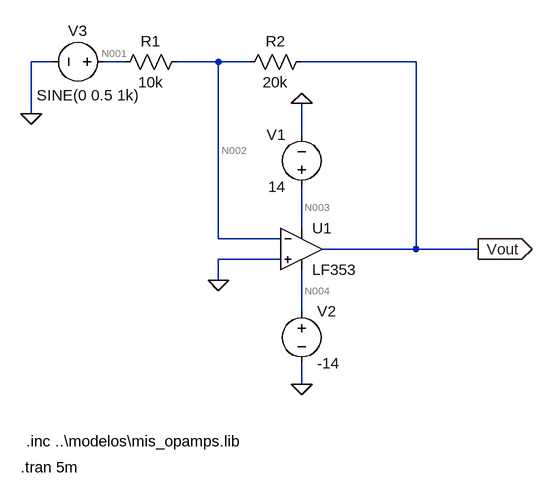
[diagram p0: schematic LF353.asc]
LF353.asc, the LTspice schematic file:
Version 4.1
SHEET 1 880 680
WIRE -16 -48 -48 -48
WIRE 96 -48 64 -48
WIRE 240 -48 176 -48
WIRE 288 -48 240 -48
WIRE 544 -48 368 -48
WIRE -48 32 -48 -48
WIRE 368 64 368 16
WIRE 368 208 368 144
WIRE 240 224 240 -48
WIRE 336 224 240 224
WIRE 544 240 544 -48
WIRE 544 240 400 240
WIRE 640 240 544 240
WIRE 336 256 240 256
WIRE 240 288 240 256
WIRE 368 336 368 272
WIRE 368 448 368 416
FLAG 368 16 0
FLAG 368 448 0
FLAG 240 288 0
FLAG 640 240 Vout
IOPIN 640 240 Out
FLAG -48 32 0
SYMBOL res 192 -64 R90
WINDOW 0 0 56 VBottom 2
WINDOW 3 32 56 VTop 2
SYMATTR InstName R1
SYMATTR Value 10k
SYMBOL res 384 -64 R90
WINDOW 0 0 56 VBottom 2
WINDOW 3 32 56 VTop 2
SYMATTR InstName R2
SYMATTR Value 20k
SYMBOL OpAmps\\opamp2 368 176 R0
SYMATTR InstName U1
SYMATTR Value LF353
SYMBOL voltage 368 160 R180
WINDOW 0 24 96 Left 2
WINDOW 3 24 16 Left 2
SYMATTR InstName V1
SYMATTR Value 14
SYMBOL voltage 368 320 R0
SYMATTR InstName V2
SYMATTR Value -14
SYMBOL voltage 80 -48 R90
WINDOW 0 -32 56 VBottom 2
WINDOW 3 36 40 VTop 2
WINDOW 123 0 0 Left 0
WINDOW 39 0 0 Left 0
SYMATTR InstName V3
SYMATTR Value SINE(0 0.5 1k)
TEXT -64 576 Left 2 !.tran 5m
TEXT -56 536 Left 2 !.inc ..\\modelos\\mis_opamps.lib

The netlist it stands for:
* LF353.asc
R1 N002 N001 10k
R2 Vout N002 20k
X§U1 0 N002 N003 N004 Vout LF353  ; pins In+ In- V+ V- OUT
V1 N003 0 14
V2 N004 0 -14
V3 N001 0 SINE(0 0.5 1k)
.tran 5m
.inc ..\modelos\mis_opamps.lib
.backanno
.end

* Results of the author's LTspice run, read from the files saved beside the schematic
* Operating Point, zero values left out:
*   V(n002) = 1.908 µV
*   V(n003) = 14 V
*   V(n004) = -14 V
*   V(vout) = 6.503 µV
*   I(R1) = 190.8 pA
*   I(R2) = 229.8 pA
*   I(V1) = -2.062 mA
*   I(V2) = 2.062 mA
*   I(V3) = 190.8 pA
*   Ix(u1:1) = 39.03 pA
*   Ix(u1:2) = 39.03 pA
*   Ix(u1:3) = 2.062 mA
*   Ix(u1:4) = -2.062 mA
*   Ix(u1:5) = -229.8 pA
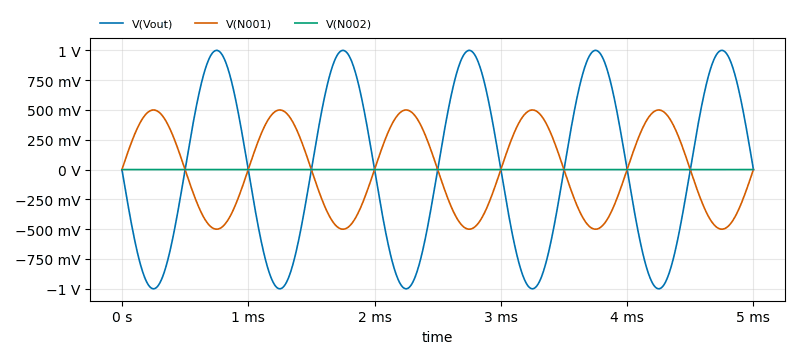
[diagram p1: Transient Analysis of LF353.asc, plotted from the saved traces]
* Transient Analysis, 1 run:
*   V(Vout): min -1 V, max 1 V, average 6.479 µV, rms 707.1 mV, last 913.4 µV
*   V(N001): min -500 mV, max 500 mV, average 0 V, rms 353.6 mV, last 0 V
*   V(N002): min -300.6 µV, max 304.4 µV, average 1.9 µV, rms 213.9 µV, last 304.2 µV